# EAGLE schematic RangeFinder (EAGLE 9.6.2)
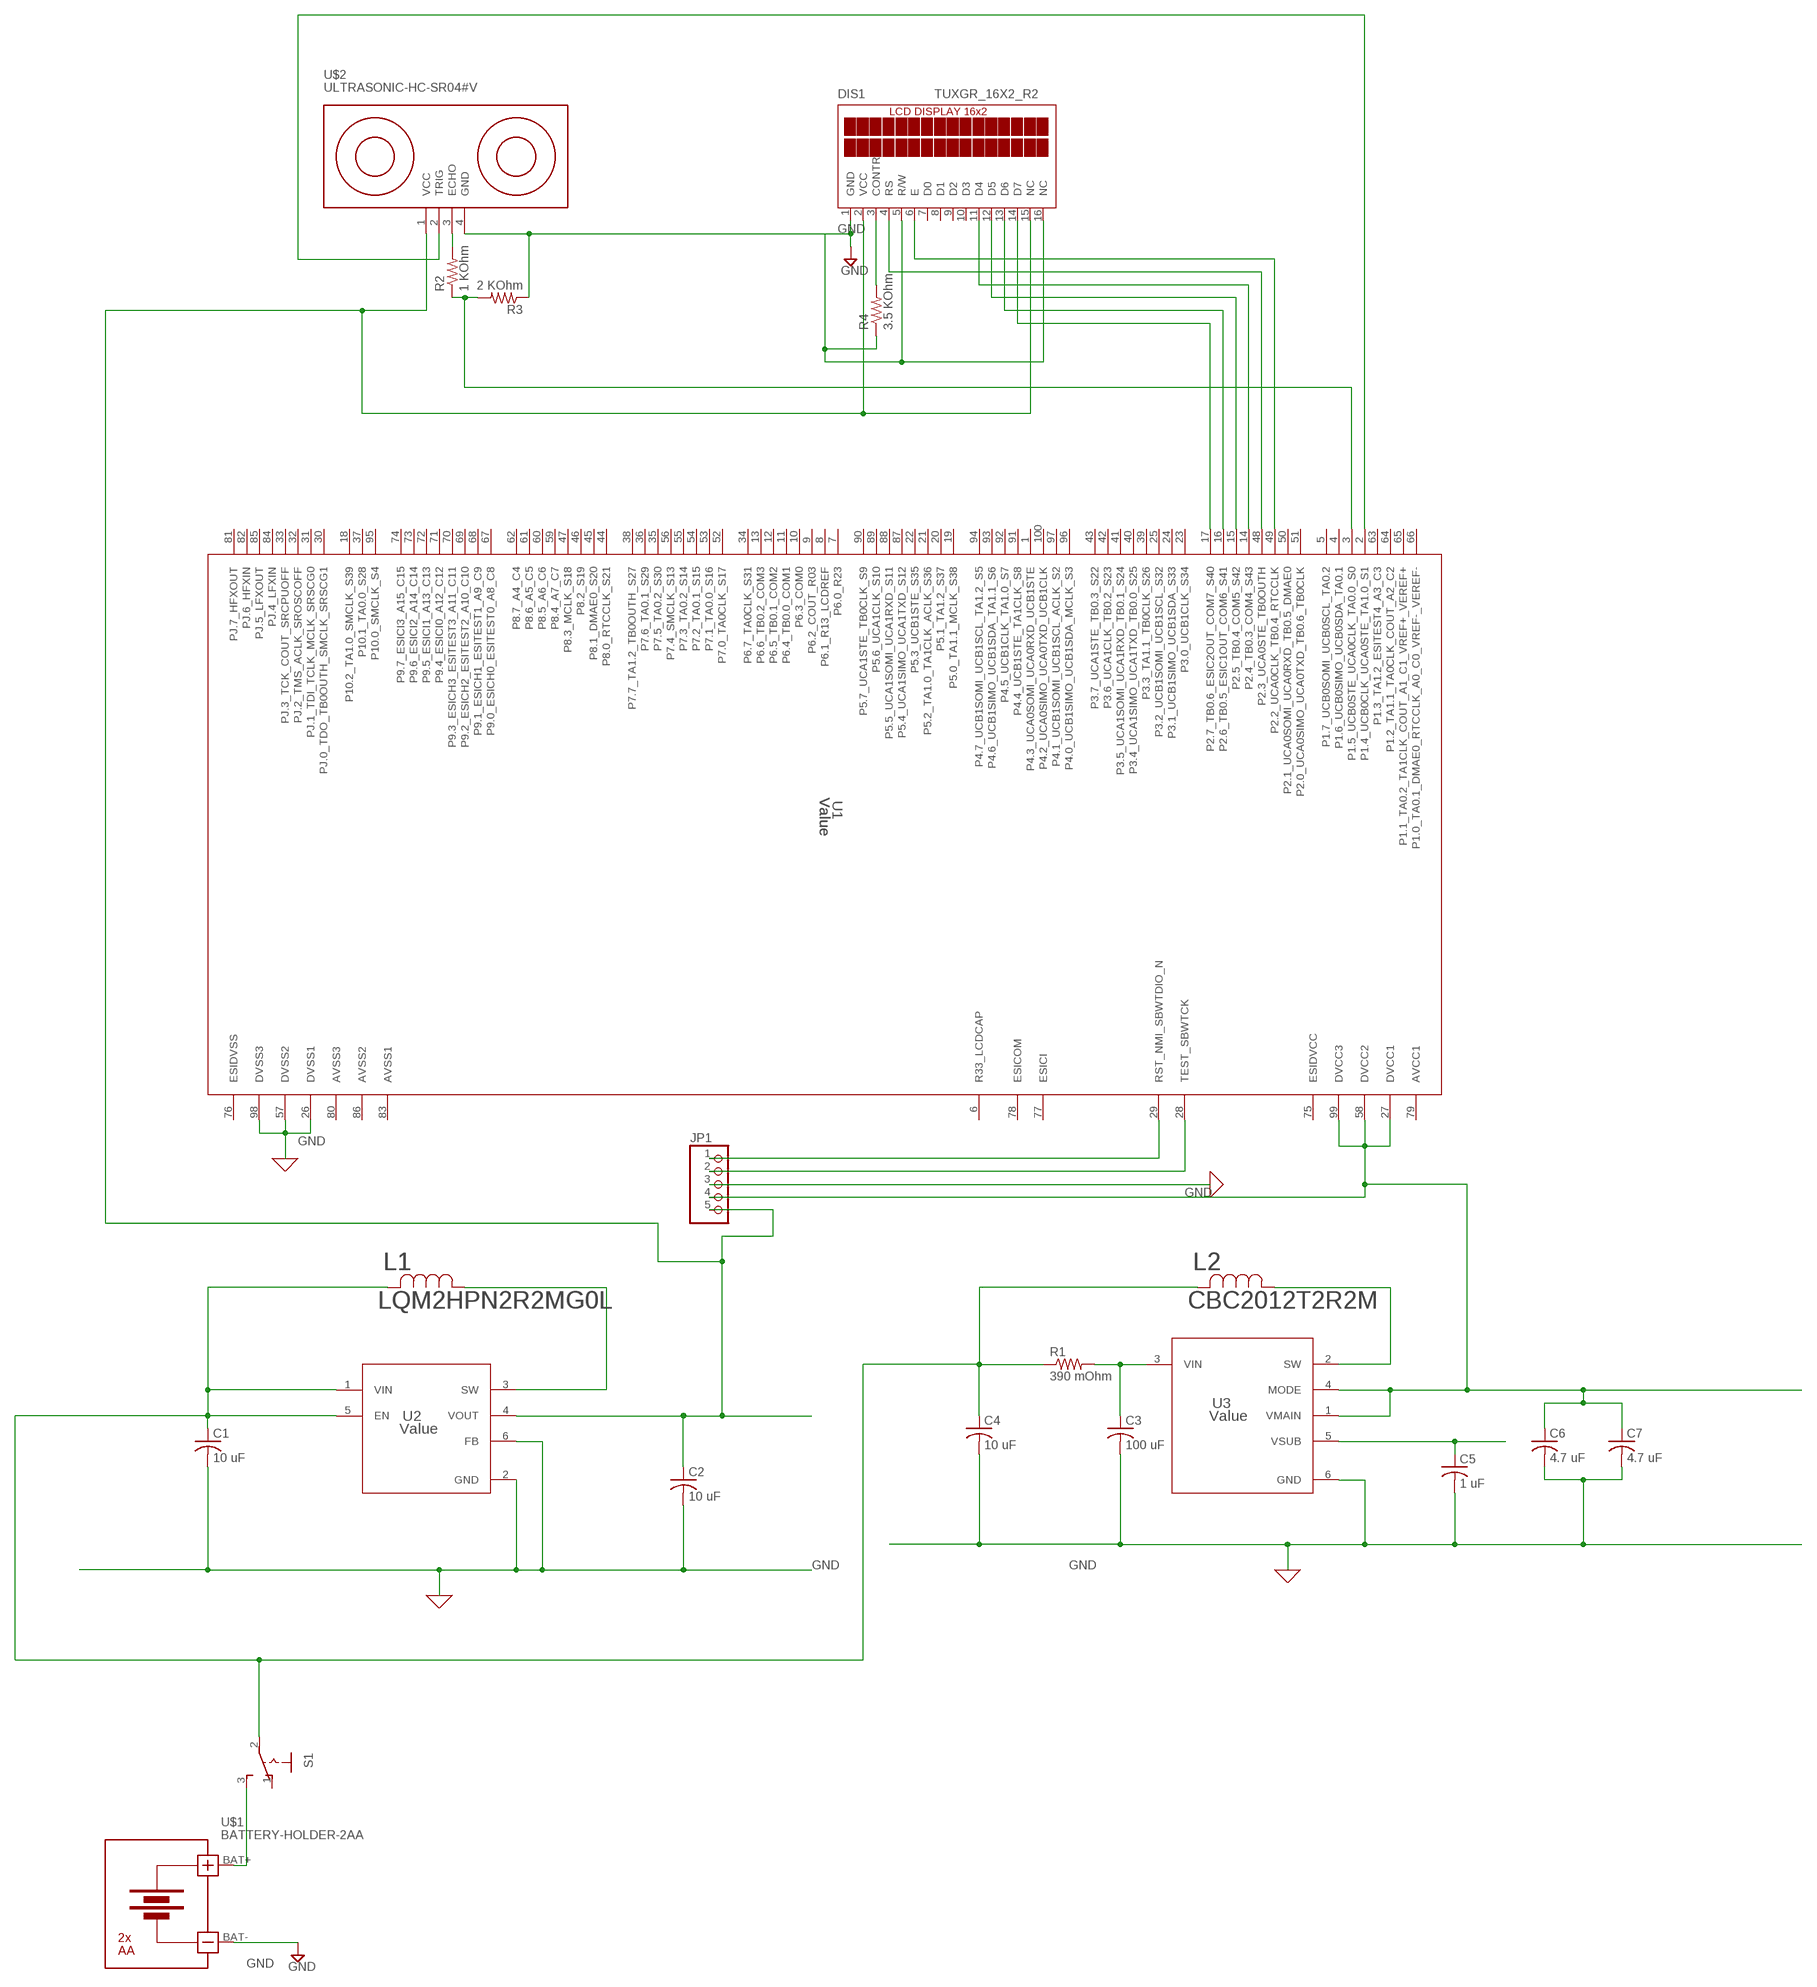
[diagram p0: schematic, sheet 1]

## Parts
C1  10 uF  C-USC0805  [C0805]
C2  10 uF  C-USC0805  [C0805]
C3  100 uF  C-USC0805  [C0805]
C4  10 uF  C-USC0805  [C0805]
C5  1 uF  C-USC0805  [C0805]
C6  4.7 uF  C-USC0805  [C0805]
C7  4.7 uF  C-USC0805  [C0805]
DIS1  TUXGR_16X2_R2  [TUXGR_16X2_R2]
JP1  PINHD-1X5  [1X05]
L1  LQM2HPN2R2MG0L  [IND_LQM2HPN2R2MG0L_MUR]
L2  CBC2012T2R2M  [IND_TAIYO_CBC2012_TAY]
R1  390 mOhm  R-US_R0805  [R0805]
R2  1 KOhm  R-US_R0805  [R0805]
R3  2 KOhm  R-US_R0805  [R0805]
R4  3.5 KOhm  R-US_R0805  [R0805]
S1  255SB  [255SB]
U1  Value  MSP430FR6989IPZRPZ0100A_L  [PZ0100A_L]
U2  Value  TPS610997YFFR  [YFF0006AFAD]
U3  Value  TPS610981DSER  [DSE0006A]
U$1  BATTERY-HOLDER-2AA  [BATTERY-HOLDER-2AA]
U$2  ULTRASONIC-HC-SR04#V  [ULTRASONIC-HC-SR04#V]

## Nets
GND: C1.2 C2.2 C3.2 C4.2 C5.2 C6.2 C7.2 DIS1.1(GND) DIS1.5(R/W) DIS1.16(NC) JP1.3 R3.1 R4.1 U1.26(DVSS1) U1.57(DVSS2) U1.98(DVSS3) U2.2(GND) U2.6(FB) U3.6(GND) U$1.BAT- U$2.4(GND)
N$1: C3.1 R1.2 U3.3(VIN)
N$2: S1.3(S) U$1.BAT+
N$3: C5.1 U3.5(VSUB)
N$4: C1.1 C4.1 L1.2 L2.2 R1.1 S1.2(P) U2.1(VIN) U2.5(EN)
N$5: C6.1 C7.1 JP1.4 U1.27(DVCC1) U1.58(DVCC2) U1.99(DVCC3) U3.1(VMAIN) U3.4(MODE)
N$6: JP1.1 U1.29(RST_NMI_SBWTDIO_N)
N$7: L2.1 U3.2(SW)
N$8: JP1.2 U1.28(TEST_SBWTCK)
N$9: R2.1 R3.2 U1.3(P1.5_UCB0STE_UCA0CLK_TA0.0_S0)
N$10: L1.1 U2.3(SW)
N$12: R2.2 U$2.3(ECHO)
N$13: DIS1.3(CONTR) R4.2
N$14: U1.2(P1.4_UCB0CLK_UCA0STE_TA1.0_S1) U$2.2(TRIG)
N$15: DIS1.11(D4) U1.14(P2.4_TB0.3_COM4_S43)
N$16: DIS1.12(D5) U1.15(P2.5_TB0.4_COM5_S42)
N$17: DIS1.13(D6) U1.16(P2.6_TB0.5_ESIC1OUT_COM6_S41)
N$18: DIS1.14(D7) U1.17(P2.7_TB0.6_ESIC2OUT_COM7_S40)
N$19: DIS1.6(E) U1.49(P2.2_UCA0CLK_TB0.4_RTCCLK)
N$20: DIS1.4(RS) U1.48(P2.3_UCA0STE_TB0OUTH)
N$21: C2.1 DIS1.2(VCC) DIS1.15(NC) JP1.5 U2.4(VOUT) U$2.1(VCC)
Unconnected: DIS1.7(D0) DIS1.8(D1) DIS1.9(D2) DIS1.10(D3) S1.1(O) U1.1(P4.3_UCA0SOMI_UCA0RXD_UCB1STE) U1.4(P1.6_UCB0SIMO_UCB0SDA_TA0.1) U1.5(P1.7_UCB0SOMI_UCB0SCL_TA0.2) U1.6(R33_LCDCAP) U1.7(P6.0_R23) U1.8(P6.1_R13_LCDREF) U1.9(P6.2_COUT_R03) U1.10(P6.3_COM0) U1.11(P6.4_TB0.0_COM1) U1.12(P6.5_TB0.1_COM2) U1.13(P6.6_TB0.2_COM3) U1.18(P10.2_TA1.0_SMCLK_S39) U1.19(P5.0_TA1.1_MCLK_S38) U1.20(P5.1_TA1.2_S37) U1.21(P5.2_TA1.0_TA1CLK_ACLK_S36) U1.22(P5.3_UCB1STE_S35) U1.23(P3.0_UCB1CLK_S34) U1.24(P3.1_UCB1SIMO_UCB1SDA_S33) U1.25(P3.2_UCB1SOMI_UCB1SCL_S32) U1.30(PJ.0_TDO_TB0OUTH_SMCLK_SRSCG1) U1.31(PJ.1_TDI_TCLK_MCLK_SRSCG0) U1.32(PJ.2_TMS_ACLK_SROSCOFF) U1.33(PJ.3_TCK_COUT_SRCPUOFF) U1.34(P6.7_TA0CLK_S31) U1.35(P7.5_TA0.2_S30) U1.36(P7.6_TA0.1_S29) U1.37(P10.1_TA0.0_S28) U1.38(P7.7_TA1.2_TB0OUTH_S27) U1.39(P3.3_TA1.1_TB0CLK_S26) U1.40(P3.4_UCA1SIMO_UCA1TXD_TB0.0_S25) U1.41(P3.5_UCA1SOMI_UCA1RXD_TB0.1_S24) U1.42(P3.6_UCA1CLK_TB0.2_S23) U1.43(P3.7_UCA1STE_TB0.3_S22) U1.44(P8.0_RTCCLK_S21) U1.45(P8.1_DMAE0_S20) U1.46(P8.2_S19) U1.47(P8.3_MCLK_S18) U1.50(P2.1_UCA0SOMI_UCA0RXD_TB0.5_DMAE0) U1.51(P2.0_UCA0SIMO_UCA0TXD_TB0.6_TB0CLK) U1.52(P7.0_TA0CLK_S17) U1.53(P7.1_TA0.0_S16) U1.54(P7.2_TA0.1_S15) U1.55(P7.3_TA0.2_S14) U1.56(P7.4_SMCLK_S13) U1.59(P8.4_A7_C7) U1.60(P8.5_A6_C6) U1.61(P8.6_A5_C5) U1.62(P8.7_A4_C4) U1.63(P1.3_TA1.2_ESITEST4_A3_C3) U1.64(P1.2_TA1.1_TA0CLK_COUT_A2_C2) U1.65(P1.1_TA0.2_TA1CLK_COUT_A1_C1_VREF+_VEREF+) U1.66(P1.0_TA0.1_DMAE0_RTCCLK_A0_C0_VREF-_VEREF-) U1.67(P9.0_ESICH0_ESITEST0_A8_C8) U1.68(P9.1_ESICH1_ESITEST1_A9_C9) U1.69(P9.2_ESICH2_ESITEST2_A10_C10) U1.70(P9.3_ESICH3_ESITEST3_A11_C11) U1.71(P9.4_ESICI0_A12_C12) U1.72(P9.5_ESICI1_A13_C13) U1.73(P9.6_ESICI2_A14_C14) U1.74(P9.7_ESICI3_A15_C15) U1.77(ESICI) U1.78(ESICOM) U1.81(PJ.7_HFXOUT) U1.82(PJ.6_HFXIN) U1.84(PJ.4_LFXIN) U1.85(PJ.5_LFXOUT) U1.87(P5.4_UCA1SIMO_UCA1TXD_S12) U1.88(P5.5_UCA1SOMI_UCA1RXD_S11) U1.89(P5.6_UCA1CLK_S10) U1.90(P5.7_UCA1STE_TB0CLK_S9) U1.91(P4.4_UCB1STE_TA1CLK_S8) U1.92(P4.5_UCB1CLK_TA1.0_S7) U1.93(P4.6_UCB1SIMO_UCB1SDA_TA1.1_S6) U1.94(P4.7_UCB1SOMI_UCB1SCL_TA1.2_S5) U1.95(P10.0_SMCLK_S4) U1.96(P4.0_UCB1SIMO_UCB1SDA_MCLK_S3) U1.97(P4.1_UCB1SOMI_UCB1SCL_ACLK_S2) U1.100(P4.2_UCA0SIMO_UCA0TXD_UCB1CLK)

## Power pins joined to a net without a drawn wire
AVCC1: U1.79(AVCC1)
AVSS1: U1.83(AVSS1)
AVSS2: U1.86(AVSS2)
AVSS3: U1.80(AVSS3)
ESIDVCC: U1.75(ESIDVCC)
ESIDVSS: U1.76(ESIDVSS)

## Library data of the parts
C1 C2 C4 C6 C7 = rcl:C-US: CAPACITOR, American symbol; MF: TAIYO YUDEN; MPN: TMK212BBJ106MG-T; OC_NEWARK: 08AH2212; SPICEPREFIX: C
C3 = rcl:C-US: CAPACITOR, American symbol; MF: TAIYO YUDEN; MPN: PMK212BBJ107MG-T.; OC_NEWARK: 29AC9540; SPICEPREFIX: C
C5 = rcl:C-US: CAPACITOR, American symbol; MF: MULTICOMP PRO; MPN: MC0805F105Z500CT; OC_NEWARK: 06R3936; SPICEPREFIX: C
DIS1 = display-lcd:TUXGR_16X2_R2: Tuxgraphics LCD display 16x2 characters reflective, without background light Source: tuxgr_12x2_r2.pdf; MF: MIDAS; MPN: MC21605C6W-BNMLW-V2; OC_FARNELL: unknown; OC_NEWARK: 03AC3426
JP1 = pinhead:PINHD-1X5: PIN HEADER; MF: MULTICOMP PRO; MPN: 2211S-05G; OC_NEWARK: 08N6747
L1 = JD-RangeFinder:LQM2HPN2R2MG0L; BUILT_BY: EMA_Cory; COPYRIGHT: Copyright (C) 2018 Accelerated Designs. All rights reserved; DATASHEET: https://search.murata.co.jp/Ceramy/image/img/P02/JELF243B-0019.pdf; MANUFACTURER_PART_NUMBER: LQM2HPN2R2MG0L; MF: MURATA; MPN: LQM2HPN2R2MG0L; OC_NEWARK: 45Y5436; SOURCELIBRARY: Murata_2020-08-06; VENDOR: Murata
L2 = JD-RangeFinder:CBC2012T2R2M; BUILT_BY: EMA_UL_Team; MANUFACTURER_PART_NUMBER: CBC2012T2R2M; MF: TAIYO YUDEN; MPN: CBC2012T2R2M.; OC_NEWARK: 29AC3034; SOURCELIBRARY: TaiyoYuden_2011-01-01_IND_CB; VENDOR: TAIYO YUDEN
R1 = rcl:R-US_: RESISTOR, American symbol; MF: PANASONIC; MPN: ERJ-6DQJR39V; OC_NEWARK: 68AC0178; SPICEPREFIX: R
R2 = rcl:R-US_: RESISTOR, American symbol; MF: MULTICOMP PRO; MPN: MCPWR05FTEW1001; OC_NEWARK: 43T5414; SPICEPREFIX: R
R3 = rcl:R-US_: RESISTOR, American symbol; MF: PANASONIC; MPN: ERA-6AEB202V; OC_NEWARK: 40P0008; SPICEPREFIX: R
R4 = rcl:R-US_: RESISTOR, American symbol; MF: TT ELECTRONICS / WELWYN; MPN: PCF0805R-3K57BT1; OC_NEWARK: 50M4615; SPICEPREFIX: R
S1 = switch:255SB: SLIDING SWITCH Distributor Buerklin, 11G810; MF: E-SWITCH; MPN: EG1218; OC_NEWARK: 15N7301
U1 = JD-RangeFinder:MSP430FR6989IPZR; ALTERNATE_PARTNUMBER: MSP430FR6989IPZ; COMPTYPE: IC; MANUFACTURER: Texas Instruments; MF: TEXAS INSTRUMENTS; MOUNTTYPE: SMT; MPN: MSP432P401RIPZR; OC_NEWARK: 28AH4232; PACKAGEREFERENCE: PZ0100A; PARTNUMBER: MSP430FR6989IPZR; PIN_COUNT: 100; REFDES: RefDes; ROHS: Y; TYPE: TYPE
U2 = JD-RangeFinder:TPS610997YFFR; MANUFACTURER: Texas Instruments; MANUFACTURER_NAME: Texas Instruments; MANUFACTURER_PART_NUMBER: TPS610997YFFR; OC_NEWARK: unknown; PARTNUMBER: TPS610997YFFR; REFDES: RefDes; TYPE: TYPE
U3 = JD-RangeFinder:TPS610981DSER; ALTERNATEPARTNUMBER: TPS610981DSET; APPLICATION_BUILDNUMBER: *; COMPTYPE: IC; MANUFACTURER: Texas Instruments; MANUFACTURER_NAME: Texas Instruments; MANUFACTURER_PART_NUMBER: TPS610981DSER; MOUNTTYPE: SMT; OC_NEWARK: unknown; PACKAGEREFERENCE: DSE0006A; PARTNUMBER: TPS610981DSER; PIN_COUNT: 6; REFDES: RefDes; ROHS: Y; TYPE: TYPE
U$1 = diy-modules:BATTERY-HOLDER-2AA: Battery Holder 2 x AA Click here to find device on ebay.com <http://www.ebay.com/sch/battery+plastic+holder+aa+2x1.5v>; MF: KEYSTONE; MPN: 2462; OC_NEWARK: 16F1091
U$2 = diy-modules:ULTRASONIC-HC-SR04: Ultrasonic Ranging Module HC-SR04 More details available here: http://randomnerdtutorials.com/complete-guide-for-ultrasonic-sensor-hc-sr04/ Click here to find device on ebay.com <http://www.ebay.com/sch/hc+sr04+ultrasonic>; MF: MCM; MPN: 83-17989; OC_NEWARK: 32AC9980